# EAGLE design chainclock (EAGLE 6.5.0)
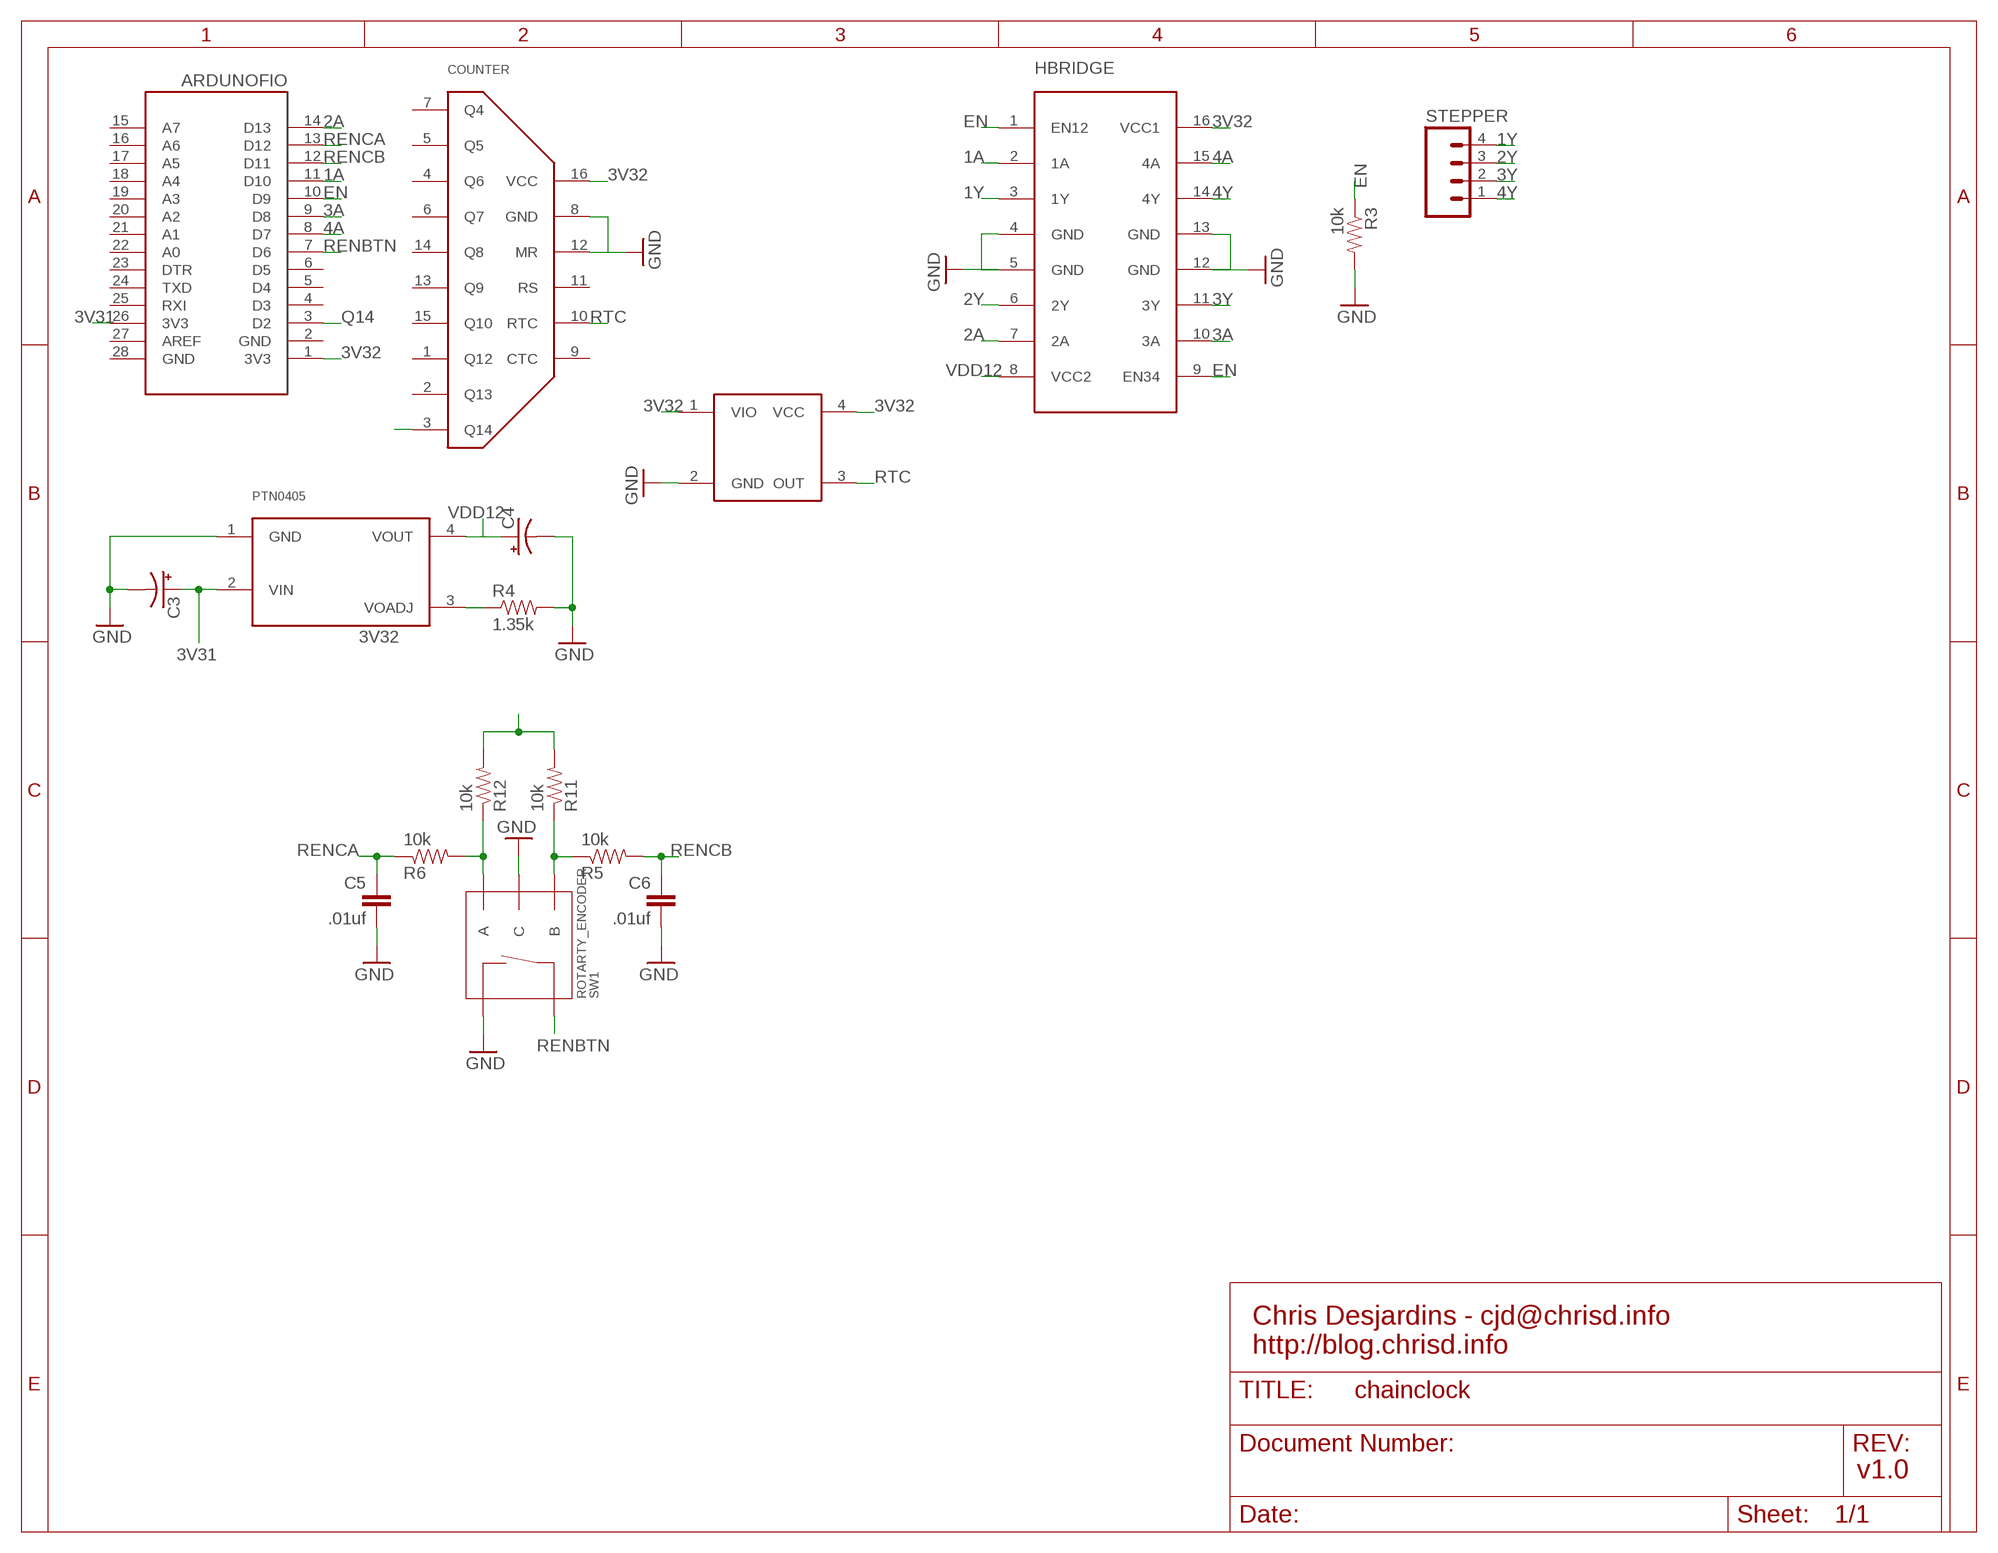
[diagram p0: schematic, sheet 1]

## Parts
ARDUNOFIO  ARDUINOFIO  [ARDUINOFIO]
C3  CAP_POLPTH1  [CPOL-RADIAL-100UF-25V]
C4  CAP_POLPTH1  [CPOL-RADIAL-100UF-25V]
C5  .01uf  CAPKIT  [CAP-PTH-SMALL-KIT]
C6  .01uf  CAPKIT  [CAP-PTH-SMALL-KIT]
COUNTER  4060  [DIL16-KIT]
HBRIDGE  SN754410  [DIL16-KIT]
PTN0405  PTN0405C  [EUU4]
R3  10k  RESISTOREZ  [AXIAL-0.3EZ]
R4  1.35k  RESISTOREZ  [AXIAL-0.3EZ]
R5  10k  RESISTOR2010  [R2010]
R6  10k  RESISTOR2010  [R2010]
R11  10k  RESISTOR2010  [R2010]
R12  10k  RESISTOR2010  [R2010]
STEPPER  M04PTH  [1X04]
SW1  ROTARTY_ENCODER  [ROTARY_ENC_PLAIN]
U$4  SG30XXJC  [SG3030JC]

## Nets
1A: ARDUNOFIO.11(D10) HBRIDGE.2(1A)
1Y: HBRIDGE.3(1Y) STEPPER.4
2A: ARDUNOFIO.14(D13) HBRIDGE.7(2A)
2Y: HBRIDGE.6(2Y) STEPPER.3
3A: ARDUNOFIO.9(D8) HBRIDGE.10(3A)
3V31: ARDUNOFIO.26(3V3) C3.1(+) PTN0405.2(VIN)
3V32: ARDUNOFIO.1(3V3) COUNTER.16(VCC) HBRIDGE.16(VCC1) R11.2 R12.2 U$4.1(VIO) U$4.4(VCC)
3Y: HBRIDGE.11(3Y) STEPPER.2
4A: ARDUNOFIO.8(D7) HBRIDGE.15(4A)
4Y: HBRIDGE.14(4Y) STEPPER.1
EN: ARDUNOFIO.10(D9) HBRIDGE.1(EN12) HBRIDGE.9(EN34) R3.P$1
GND: C3.2(-) C4.2(-) C5.2 C6.2 COUNTER.8(GND) COUNTER.12(MR) HBRIDGE.4(GND) HBRIDGE.5(GND) HBRIDGE.12(GND) HBRIDGE.13(GND) PTN0405.1(GND) R3.P$2 R4.P$2 SW1.C SW1.SW- U$4.2(GND)
N$2: R5.1 R11.1 SW1.B
N$3: PTN0405.3(VOADJ) R4.P$1
N$5: R6.2 R12.1 SW1.A
Q14: ARDUNOFIO.3(D2) COUNTER.3(Q14)
RENBTN: ARDUNOFIO.7(D6) SW1.SW+
RENCA: ARDUNOFIO.13(D12) C5.1 R6.1
RENCB: ARDUNOFIO.12(D11) C6.1 R5.2
RTC: COUNTER.10(RTC) U$4.3(OUT)
VDD12: C4.1(+) HBRIDGE.8(VCC2) PTN0405.4(VOUT)
Unconnected: ARDUNOFIO.4(D3) ARDUNOFIO.5(D4) ARDUNOFIO.6(D5) ARDUNOFIO.15(A7) ARDUNOFIO.16(A6) ARDUNOFIO.17(A5) ARDUNOFIO.18(A4) ARDUNOFIO.19(A3) ARDUNOFIO.20(A2) ARDUNOFIO.21(A1) ARDUNOFIO.22(A0) ARDUNOFIO.23(DTR) ARDUNOFIO.24(TXD) ARDUNOFIO.25(RXI) ARDUNOFIO.27(AREF) COUNTER.1(Q12) COUNTER.2(Q13) COUNTER.4(Q6) COUNTER.5(Q5) COUNTER.6(Q7) COUNTER.7(Q4) COUNTER.9(CTC) COUNTER.11(RS) COUNTER.13(Q9) COUNTER.14(Q8) COUNTER.15(Q10)

## Notes on the sheet
- Chris Desjardins - cjd@chrisd.info
  http://blog.chrisd.info
- v1.0

## Power pins joined to a net without a drawn wire
GND: ARDUNOFIO.2(GND) ARDUNOFIO.28(GND)

## Library data of the parts
ARDUNOFIO = desjardins:ARDUINOFIO
C3 C4 = SparkFun-Passives:CAP_POL: Capacitor Polarized These are standard SMD and PTH capacitors. Normally 10uF, 47uF, and 100uF in electrolytic and tantalum varieties. Always verify the external diameter of the through hole cap, it varies with capacity, voltage, and manufacturer. The EIA devices should be standard.
C5 C6 = SparkFun-Capacitors:CAP: Capacitor Standard 0603 ceramic capacitor, and 0.1" leaded capacitor.
COUNTER = desjardins:4060
HBRIDGE = desjardins:SN754410
PTN0405 = desjardins:PTN0405C
R3-R6 R11 R12 = SparkFun-Resistors:RESISTOR: Resistor Basic schematic elements and footprints for 0603, 1206, and PTH resistors.
STEPPER = SparkFun-Connectors:M04: Header 4 Standard 4-pin 0.1" header. Use with straight break away headers (SKU : PRT-00116), right angle break away headers (PRT-00553), swiss pins (PRT-00743), machine pins (PRT-00117), and female headers (PRT-00115). Molex polarized connector foot print use with SKU : PRT-08231 with associated crimp pins and housings. 1MM SMD Version SKU: PRT-10208
SW1 = SparkFun-Electromechanical:ROTARTY_ENCODER: Simple no LED rotary encoder Example: COM-09117
U$4 = desjardins:SG30XX

## Board
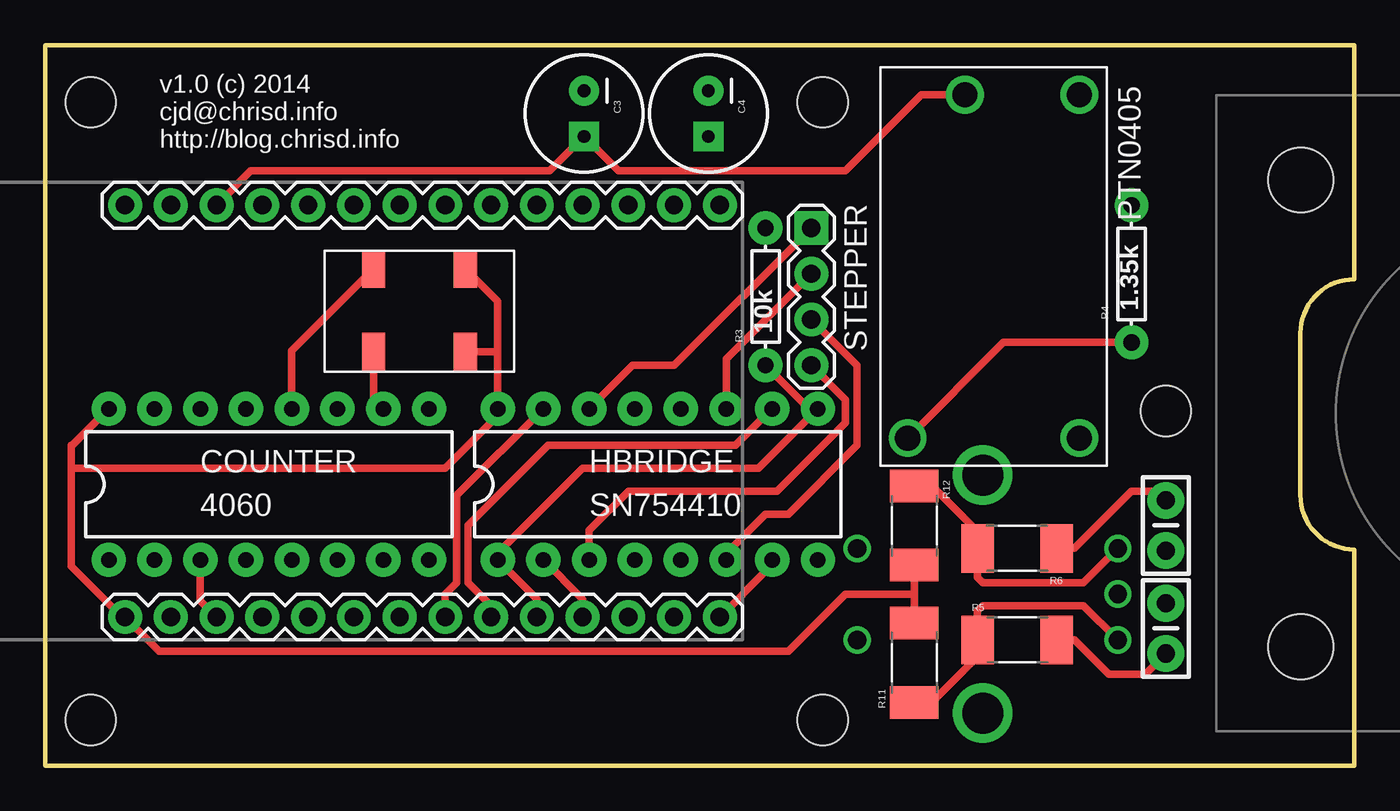
[diagram p1: board, top side]
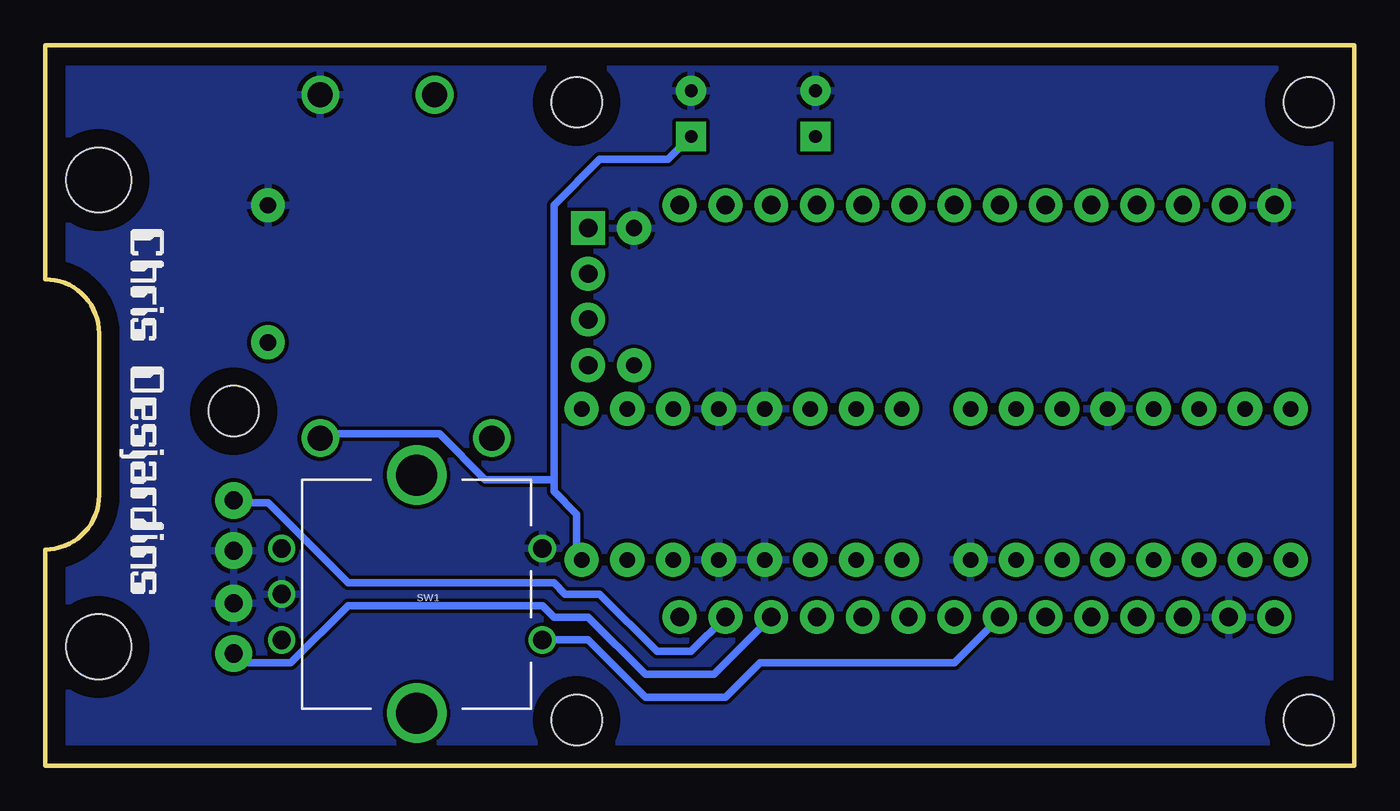
[diagram p2: board, bottom side, seen from below]

Size 72.7 x 40 mm. Coordinates in mm from the lower left corner, seen from the top.
Outline: 0,0 0,40 72.7,40 72.7,27 arc90 69.7,24 69.7,15 arc90 72.7,12 72.7,0 0,0
Copper layers (1*16): Top 0.035mm / dielectric 1.5mm / Bottom 0.035mm
Design rules "default": minimum track width 10mil, minimum drill 24mil, track to track 8mil, track to pad 8mil, pad to pad 8mil, via to via 8mil, smd to smd 8mil, copper to edge 40mil, drill to drill 8mil, minimum pad ring 10mil, minimum via ring 8mil, stop-mask expansion 4mil, vias tented up to drill 0mil, thermal gap 10mil
Holes 2.8 mm at 2.54,2.54 2.54,36.83 62.23,19.68 43.18,2.54 43.18,36.83

### Footprints (pad centres in the part's own frame; a part is rotated, then mirrored left to right if it is on the bottom)
ARDUINOFIO = drill 1.016 pad 1.88: 1 1.27,34.29; 2 1.27,31.75; 3 1.27,29.21; 4 1.27,26.67; 5 1.27,24.13; 6 1.27,21.59; 7 1.27,19.05; 8 1.27,16.51; 9 1.27,13.97; 10 1.27,11.43; 11 1.27,8.89; 12 1.27,6.35; 13 1.27,3.81; 14 1.27,1.27; 15 24.13,1.27; 16 24.13,3.81; 17 24.13,6.35; 18 24.13,8.89; 19 24.13,11.43; 20 24.13,13.97; 21 24.13,16.51; 22 24.13,19.05; 23 24.13,21.59; 24 24.13,24.13; 25 24.13,26.67; 26 24.13,29.21; 27 24.13,31.75; 28 24.13,34.29
CPOL-RADIAL-100UF-25V = drill 0.7 pad 1.651 square: 1 1.27,0 | drill 0.7 pad 1.651: 2 -1.27,0
CAP-PTH-SMALL-KIT = drill 1.016 pad 2.032: 1 -1.397,0; 2 1.397,0
DIL16-KIT = drill 0.864 pad 1.905: 1 -8.89,-4.191; 2 -6.35,-4.191; 3 -3.81,-4.191; 4 -1.27,-4.191; 5 1.27,-4.191; 6 3.81,-4.191; 7 6.35,-4.191; 8 8.89,-4.191; 9 8.89,4.191; 10 6.35,4.191; 11 3.81,4.191; 12 1.27,4.191; 13 -1.27,4.191; 14 -3.81,4.191; 15 -6.35,4.191; 16 -8.89,4.191
EUU4 = drill 1.397: 1 1.524,11.049; 2 1.524,4.699; 3 20.574,1.524; 4 20.574,11.049
AXIAL-0.3EZ = drill 0.9 pad 1.88: P$1 -3.81,0; P$2 3.81,0
R2010 = smd 1.8 x 2.7: 1 -2.2,0; 2 2.2,0
1X04 = drill 1.016 pad 1.88 square: 1 0,0 | drill 1.016 pad 1.88: 2 2.54,0; 3 5.08,0; 4 7.62,0
ROTARY_ENC_PLAIN = drill 1.016: A 7.493,-2.54; B 7.493,2.54; C 7.493,0; SW+ -6.985,2.54; SW- -6.985,-2.54 | drill 2.286: P$3 0,6.604; P$4 0,-6.604
NEMA14 = hole 3.6: 4.699,30.607; 30.607,30.607
SG3030JC = smd 1.3 x 2.1: 1 2.71,1; 2 7.79,1; 3 7.79,5.6; 4 2.71,5.6

### Placement (x,y rotation side)
ARDUNOFIO  38.73,6.99 90 top
C3  29.93,36.2 270 top
C4  36.83,36.2 270 top
C5  62.23,13.34 270 top
C6  62.23,7.62 90 top
COUNTER  12.43,15.62 0 top
HBRIDGE  34.02,15.62 0 top
PTN0405  46.37,38.76 270 top
R3  40.01,26.04 90 top
R4  60.33,27.3 90 top
R5  53.98,6.99 0 top
R6  53.98,12.06 180 top
R11  48.26,5.71 90 top
R12  48.26,13.34 270 top
STEPPER  42.55,29.84 270 top
SW1  52.07,9.53 180 bottom
U$2  [NEMA14]  100.33,1.91 90 top
U$3  [LOGO]  67.94,29.84 270 bottom
U$4  26.04,28.57 180 top

### Tracks (layer width: path | path; a pad name or v marks a point on that pad's centre or on a via)
1A
  Top 0.406: ARDUNOFIO.11 29.84,9.26 HBRIDGE.2
1Y
  Top 0.406: HBRIDGE.3 30.21,13.06 32.38,15.24 40.64,15.24 44.45,19.05 44.45,20.32 STEPPER.4
2A
  Top 0.406: ARDUNOFIO.14 40.01,10.79 40.01,11.06 HBRIDGE.7
2Y
  Top 0.406: HBRIDGE.6 37.83,11.79 40.01,13.97 41.27,13.97 45.09,17.78 45.09,22.23 STEPPER.3
3A
  Top 0.406: HBRIDGE.10 38.34,17.78 27.94,17.78 23.5,13.34 23.5,10.16 24.77,8.89 ARDUNOFIO.9
3V31
  Top 0.406: ARDUNOFIO.26 11.43,33.02 28.02,33.02 C3.1 31.83,33.02 44.45,33.02 48.67,37.24 PTN0405.2
3V32
  Top 0.406: 1.46,16.51 1.46,11.08 4.29,8.26 ARDUNOFIO.1 6.35,6.35 41.27,6.35 44.45,9.53 48.26,9.53 | 1.46,16.51 1.46,17.78 1.51,17.78 COUNTER.16 | 1.46,16.51 22.23,16.51 25.13,19.41 HBRIDGE.16 25.13,22.86 | 48.26,9.53 R12.2 | 48.26,9.53 R11.2 | 25.13,22.86 25.13,25.77 U$4.1 | U$4.4 25.02,22.98 25.13,22.86
3Y
  Top 0.406: HBRIDGE.11 37.83,22.59 STEPPER.2
4A
  Top 0.406: HBRIDGE.15 22.86,15 22.86,10.16 22.23,9.53 ARDUNOFIO.8
4Y
  Top 0.406: STEPPER.1 34.92,22.23 32.62,22.23 HBRIDGE.14
EN
  Top 0.406: ARDUNOFIO.10 27.3,9.26 HBRIDGE.1 25.13,11.79 29.84,16.51 39.61,16.51 HBRIDGE.9 42.78,19.68 42.55,19.68 R3.P$1
GND
  Top 0.406: COUNTER.12 13.7,23.03 U$4.2
  pour Bottom: 1.27,1.27 1.27,39.37 72.39,39.37 72.39,1.27
N$2
  Top 0.406: SW1.B 57.66,8.89 52.07,8.89 51.77,8.6 R5.1 52.07,6.69 52.07,6.35 49.23,3.52 R11.1
N$3
  Top 0.406: R4.P$1 53.2,23.5 PTN0405.3
N$5
  Top 0.406: SW1.A 57.66,10.16 52.07,10.16 51.77,10.46 R6.2 51.44,12.4 51.44,13.34 49.23,15.54 R12.1
Q14
  Top 0.406: COUNTER.3 8.62,9.16 ARDUNOFIO.3
RENBTN
  Bottom 0.406: ARDUNOFIO.7 22.23,5.71 33.02,5.71 34.92,3.81 39.37,3.81 42.55,6.99 SW1.SW+
RENCA
  Top 0.406: C5.1 61.72,15.24 60.33,15.24 57.15,12.06 R6.1
  Bottom 0.406: ARDUNOFIO.13 36.83,6.35 38.73,6.35 41.91,9.53 43.81,9.53 44.45,10.16 55.88,10.16 60.33,14.61 62.1,14.61 C5.1
RENCB
  Top 0.406: C6.1 61.09,5.08 59.05,5.08 57.15,6.99 R5.2
  Bottom 0.406: ARDUNOFIO.12 35.56,5.08 39.37,5.08 42.55,8.26 44.45,8.26 45.09,8.89 55.88,8.89 59.05,5.71 61.72,5.71 C6.1
RTC
  Top 0.406: U$4.3 18.25,20.35 COUNTER.10
VDD12
  Bottom 0.406: PTN0405.4 56.74,18.19 56.52,18.41 50.8,18.41 48.26,15.88 44.45,15.88 | HBRIDGE.8 43.18,11.7 43.18,13.97 44.45,15.24 44.45,15.88 | 44.45,15.88 44.45,31.11 41.91,33.66 38.1,33.66 C4.1

### Text on the board
tPlace: v1.0 (c) 2014 / cjd@chrisd.info / http://blog.chrisd.info